# EAGLE board KMO_IO_MV2_3 (EAGLE 9.4.0)
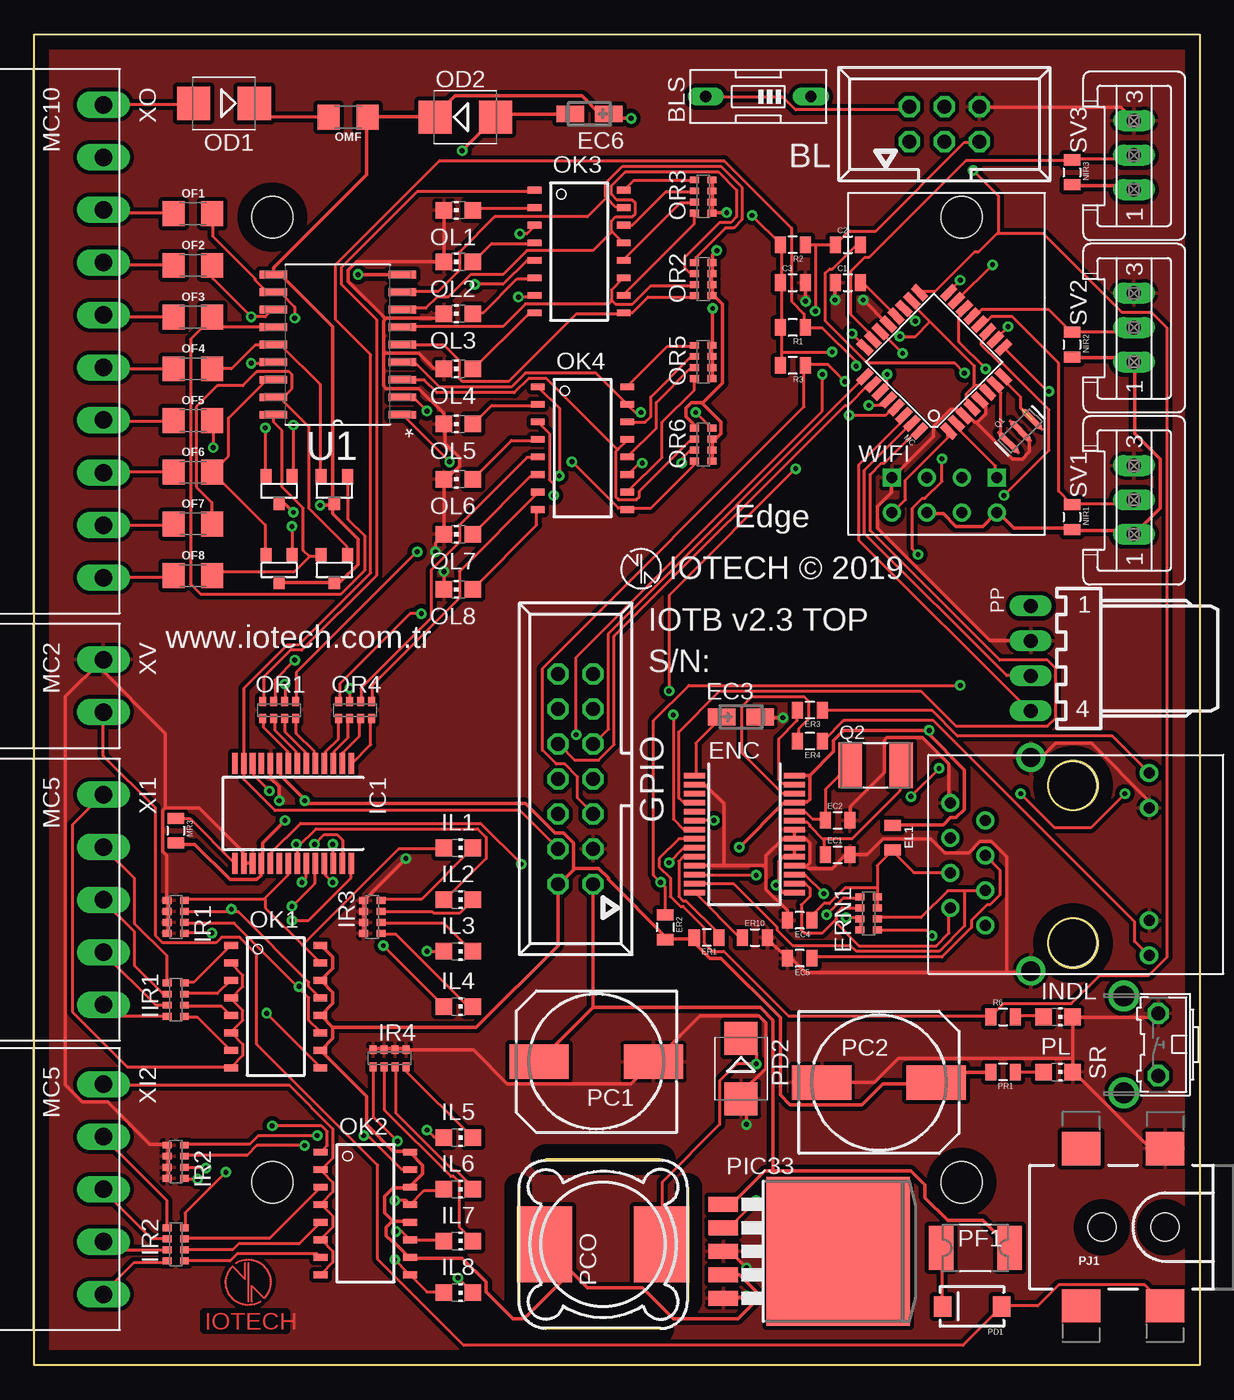
[diagram p2: board, top side]
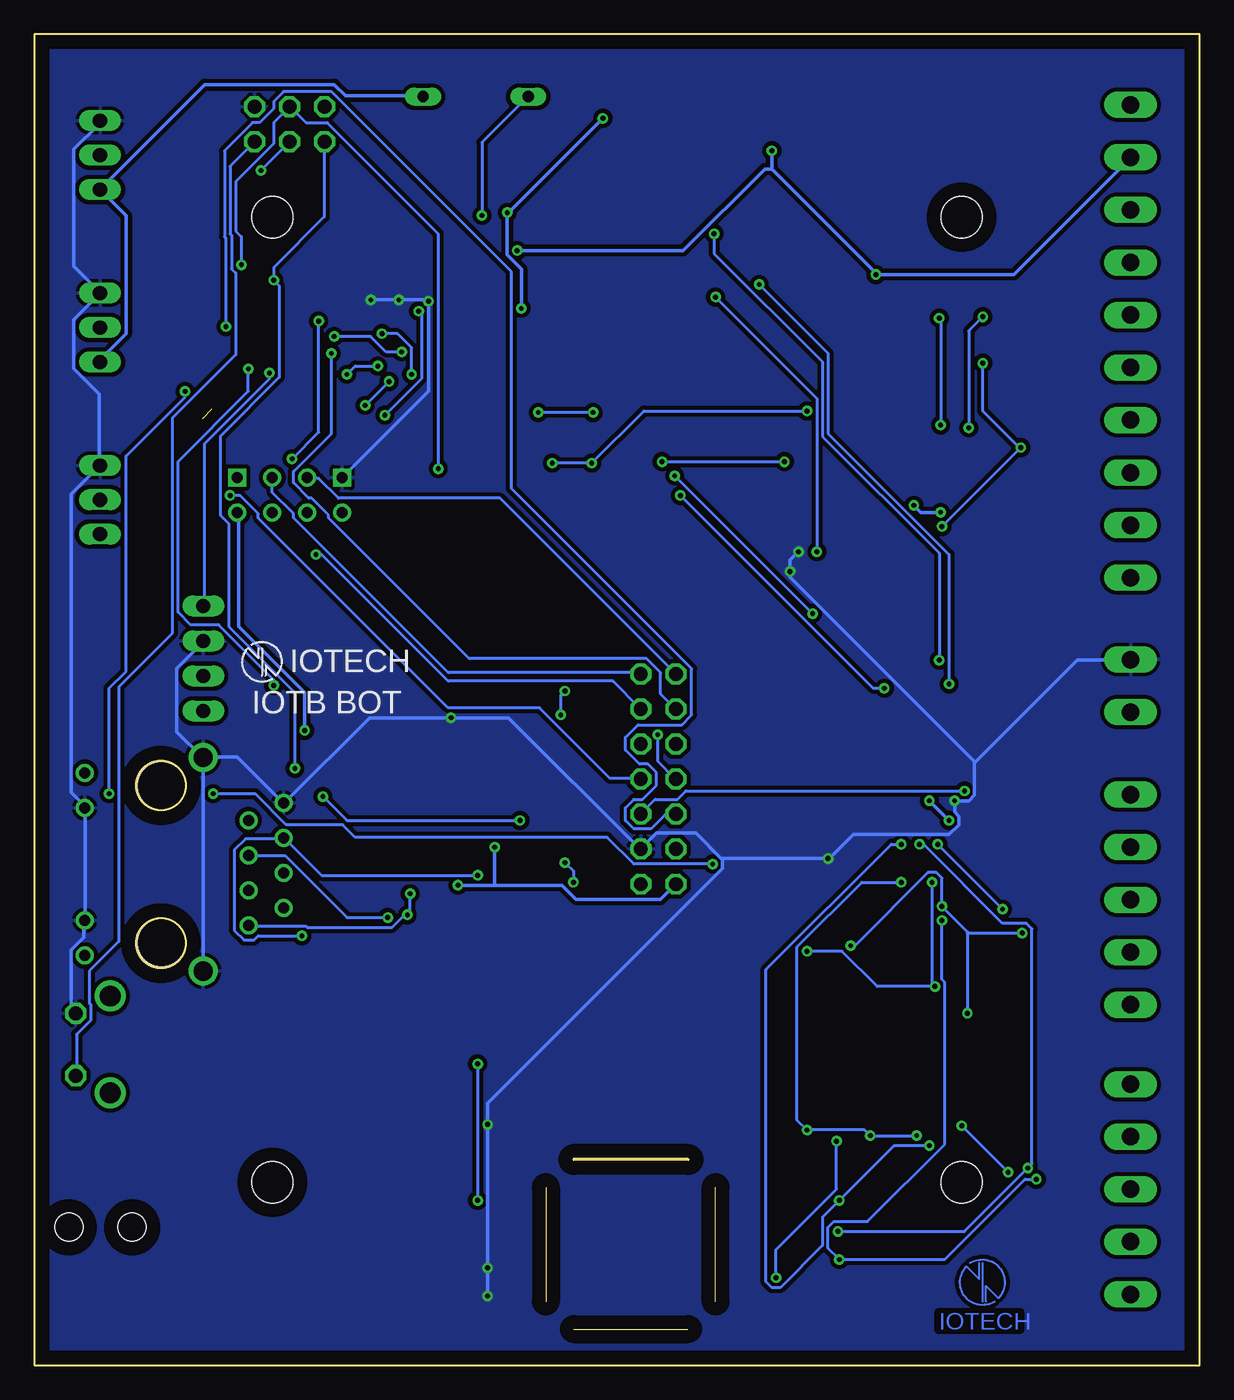
[diagram p3: board, bottom side, seen from below]

Size 84.5 x 96.5 mm. Coordinates in mm from the lower left corner, seen from the top.
Outline: 0,0 0,96.5 84.5,96.5 84.5,0 0,0
Copper layers (1*16): Top 0.035mm / dielectric 1.5mm / Bottom 0.035mm
Design rules "KMO_IO_M": minimum track width 6mil, minimum drill 0.35mm, track to track 0.205mm, track to pad 0.205mm, pad to pad 0.205mm, via to via 0.205mm, smd to smd 6mil, copper to edge 40mil, drill to drill 6mil, minimum pad ring 10mil, minimum via ring 8mil, stop-mask expansion 4mil, vias tented up to drill 0mil, thermal gap 10mil
Net classes: 0 default: width 0.203 mm, drill 0.3 mm, clearance 0.16 mm; 1 vcc: width 0.254 mm, drill 0.3 mm, clearance 0.16 mm; 2 3.3 power line: width 0.254 mm, drill 0.3 mm, clearance 0.16 mm; 3 outsise power line: width 0.254 mm, drill 0.3 mm, clearance 0.16 mm
Holes 3 mm at 17.25,83.25 67.25,83.25 17.25,13.25 67.25,13.25

## Footprints (pad centres in the part's own frame; a part is rotated, then mirrored left to right if it is on the bottom)
057-006-1 = drill 1 octagon: 1 -2.54,-1.27; 2 -2.54,1.27; 3 0,-1.27; 4 0,1.27; 5 2.54,-1.27; 6 2.54,1.27
EDG-01 = drill 0.813 long: 1 0,-3.81; 2 0,3.81
0805 = smd 0.8 x 1.2: 1 -0.9,0; 2 0.9,0
SOT-23-3 = smd 0.802 x 0.972: 1 -0.95,-1; 2 0.95,-1; 3 0,1
CT3216 = smd 2 x 1.2: + -1.4,0; - 1.4,0
SSOP28 = smd 0.4 x 1.5: 1 -4.225,-3.625; 2 -3.575,-3.625; 3 -2.925,-3.625; 4 -2.275,-3.625; 5 -1.625,-3.625; 6 -0.975,-3.625; 7 -0.325,-3.625; 8 0.325,-3.625; 9 0.975,-3.625; 10 1.625,-3.625; 11 2.275,-3.625; 12 2.925,-3.625; 13 3.575,-3.625; 14 4.225,-3.625; 15 4.225,3.625; 16 3.575,3.625; 17 2.925,3.625; 18 2.275,3.625; 19 1.625,3.625; 20 0.975,3.625; 21 0.325,3.625; 22 -0.325,3.625; 23 -0.975,3.625; 24 -1.625,3.625; 25 -2.275,3.625; 26 -2.925,3.625; 27 -3.575,3.625; 28 -4.225,3.625
0603-ARV = smd 0.5 x 0.65: 1 -1.2,-0.625; 2 -0.4,-0.625; 3 0.4,-0.625; 4 1.2,-0.625; 5 1.2,0.625; 6 0.4,0.625; 7 -0.4,0.625; 8 -1.2,0.625
057-014-1 = drill 1 octagon: 1 -7.62,-1.27; 2 -7.62,1.27; 3 -5.08,-1.27; 4 -5.08,1.27; 5 -2.54,-1.27; 6 -2.54,1.27; 7 0,-1.27; 8 0,1.27; 9 2.54,-1.27; 10 2.54,1.27; 11 5.08,-1.27; 12 5.08,1.27; 13 7.62,-1.27; 14 7.62,1.27
CHIP-LED0805 = smd 1.2 x 1.2: A 0,-1.05; C 0,1.05
TQFP32-08 = smd 1.27 x 0.559: 1 -4.293,2.8; 2 -4.293,2; 3 -4.293,1.2; 4 -4.293,0.4; 5 -4.293,-0.4; 6 -4.293,-1.2; 7 -4.293,-2; 8 -4.293,-2.8; 17 4.293,-2.8; 18 4.293,-2; 19 4.293,-1.2; 20 4.293,-0.4; 21 4.293,0.4; 22 4.293,1.2; 23 4.293,2; 24 4.293,2.8 | smd 0.559 x 1.27: 9 -2.8,-4.293; 10 -2,-4.293; 11 -1.2,-4.293; 12 -0.4,-4.293; 13 0.4,-4.293; 14 1.2,-4.293; 15 2,-4.293; 16 2.8,-4.293; 25 2.8,4.293; 26 2,4.293; 27 1.2,4.293; 28 0.4,4.293; 29 -0.4,4.293; 30 -1.2,4.293; 31 -2,4.293; 32 -2.8,4.293
SMB = smd 2.4 x 2.4: A 2.2,0; C -2.2,0
1206 = smd 1.6 x 1.8: 1 -1.4,0; 2 1.4,0
MINI-FLAT-16 = smd 1 x 0.5: 1 -3.24,4.445; 2 -3.24,3.175; 3 -3.24,1.905; 4 -3.24,0.635; 5 -3.24,-0.635; 6 -3.24,-1.905; 7 -3.24,-3.175; 8 -3.24,-4.445; 9 3.24,-4.445; 10 3.24,-3.175; 11 3.24,-1.905; 12 3.24,-0.635; 13 3.24,0.635; 14 3.24,1.905; 15 3.24,3.175; 16 3.24,4.445
140CLH-1010 = smd 4.3 x 2.5: + 4.15,0; - -4.15,0
MSS1260 = smd 5.5 x 4: P$1 0,4.25; P$2 0,-4.25
SMA-DIODE = smd 1.27 x 1.47: A -2.15,0; C 2.15,0
1820 = smd 1.78 x 3.2: 1 -2.49,0; 2 2.49,0
TO263-5 = smd 1.067 x 2.159: 1 -3.404,-5.791; 2 -1.702,-5.791; 3 0,-5.791; 4 1.702,-5.791; 5 3.404,-5.791 | smd 10.8 x 10.41: 6 0,2.54
POWER_JACK_SMD_OVERPASTE_TOE = smd 2.8 x 2.4: GND 0,-5.7; P$4 6.1,-5.7; VIN0 0,5.7; VIN1 6.1,5.7 | hole 2.032: 0,0; 4.572,0
7395-04 = drill 1.016 long: 1 3.81,0; 2 1.27,0; 3 -1.27,0; 4 -3.81,0
RESONATOR-SMD-1:1 = smd 0.45 x 1.905: 1 -1.2,0; 2 0,0; 3 1.2,0
5.0X3.2_2 = smd 1.7 x 3.3: 1 -1.85,0; 2 1.85,0
B3F-31XX = drill 1.016 octagon: 1 -2.261,-1.245; 2 2.261,-1.245 | drill 1.499 pad 2.159: 3 -3.505,1.245; 4 3.505,1.245
S03P = drill 1.016 long: 1 2.5,0; 2 0,0; 3 -2.5,0
SOIC127P1030X265-18N = smd 1.981 x 0.559: 1 -4.674,5.08; 2 -4.674,3.81; 3 -4.674,2.54; 4 -4.674,1.27; 5 -4.674,0; 6 -4.674,-1.27; 7 -4.674,-2.54; 8 -4.674,-3.81; 9 -4.674,-5.08; 10 4.674,-5.08; 11 4.674,-3.81; 12 4.674,-2.54; 13 4.674,-1.27; 14 4.674,0; 15 4.674,1.27; 16 4.674,2.54; 17 4.674,3.81; 18 4.674,5.08
RJ45 = drill 0.8: G+ 5.84,-6.305; G- 5.84,-3.765; GND -8.57,4.76; NC -6.03,3.5; P4 -8.57,-0.32; P5 -6.03,0.96; RD+ -6.03,-1.58; RD- -8.57,2.22; TD+ -6.03,-4.12; TD- -8.57,-2.86; Y+ 5.84,6.945; Y- 5.84,4.405 | drill 1.4: SHIELD1 -2.73,-7.425; SHIELD2 -2.73,8.065 | hole 3.5: 0.3,-5.38; 0.3,6.02
ESP01 = drill 0.8: CH_PD -1.285,-8.178; GPIO0 1.255,-5.638; GPIO2 -1.285,-5.638; RST 1.255,-8.178; TX -3.825,-8.178; VCC 3.795,-8.178 | drill 0.8 square: GND -3.825,-5.638; RX 3.795,-5.638
MC5 = drill 1.27 long: 1 -7.62,0; 2 -3.81,0; 3 0,0; 4 3.81,0; 5 7.62,0
MC10 = drill 1.27 long: 1 -17.145,0; 2 -13.335,0; 3 -9.525,0; 4 -5.715,0; 5 -1.905,0; 6 1.905,0; 7 5.715,0; 8 9.525,0; 9 13.335,0; 10 17.145,0
MC2 = drill 1.27 long: 1 -1.905,0; 2 1.905,0

## Placement (x,y rotation side)
BL  057-006-1  [057-006-1]  66,90 0 top
BLS  on-off  [EDG-01]  52.5,92 90 top
C1  100nF  [0805]  59,78.5 0 top
C2  100nF  [0805]  59,81.25 0 top
C3  100nF  [0805]  55,78.5 0 top
D1  BAV70  [SOT-23-3]  21.75,57.75 180 top
D2  BAV70  [SOT-23-3]  17.75,57.75 180 top
D3  BAV70  [SOT-23-3]  21.75,63.5 180 top
D4  BAV70  [SOT-23-3]  17.75,63.5 180 top
EC1  18p  [0805]  58.25,37 0 top
EC2  18p  [0805]  58.25,39.5 0 top
EC3  10u  [CT3216]  51.25,47 0 top
EC4  10n  [0805]  55.5,32.25 180 top
EC5  10n  [0805]  55.5,29.5 180 top
EC6  10u  [CT3216]  40.25,90.75 180 top
EL1  10µH  [0805]  62.25,38.25 270 top
ENC  ENC28J60-SSOP  [SSOP28]  51.5,38.5 270 top
ER1  10k  [0805]  48.75,31 180 top
ER2  10k  [0805]  45.75,31.75 270 top
ER3  1k  [0805]  56.25,47.5 180 top
ER4  1k  [0805]  56.25,45.25 180 top
ER10  2.7K  [0805]  52.25,31 0 top
ERN1  49.9R  [0603-ARV]  60.5,32.75 270 top
GPIO  057-014-1  [057-014-1]  39.25,42.5 90 top
IC1  MCP23017SS  [SSOP28]  18.75,40 180 top
IIR1  6.8K  [0603-ARV]  10.25,26.5 270 top
IIR2  6.8K  [0603-ARV]  10.25,8.75 270 top
IL1  BLU  [CHIP-LED0805]  30.75,37.5 270 top
IL2  BLU  [CHIP-LED0805]  30.75,33.75 270 top
IL3  BLU  [CHIP-LED0805]  30.75,30 270 top
IL4  BLU  [CHIP-LED0805]  30.75,26 270 top
IL5  BLU  [CHIP-LED0805]  30.75,16.5 270 top
IL6  BLU  [CHIP-LED0805]  30.75,12.75 270 top
IL7  BLU  [CHIP-LED0805]  30.75,9 270 top
IL8  BLU  [CHIP-LED0805]  30.75,5.25 270 top
INDL  BLU  [CHIP-LED0805]  74.25,25.25 270 top
IR1  10K  [0603-ARV]  10.25,32.5 90 top
IR2  10K  [0603-ARV]  10.25,14.75 90 top
IR3  1K  [0603-ARV]  24.5,32.5 270 top
IR4  1K  [0603-ARV]  25.75,22.25 180 top
MC  ATMEGA328  [TQFP32-08]  65.25,72.75 135 top
MR3  10K  [0805]  10.25,38.75 270 top
NIR1  4700  [0805]  75.25,61.5 270 top
NIR2  4700  [0805]  75.25,74 270 top
NIR3  4700  [0805]  75.25,86.5 270 top
OD1  SS54  [SMB]  13.75,91.5 180 top
OD2  28V  [SMB]  31.25,90.5 0 top
OF1  100mA  [1206]  11.5,83.5 0 top
OF2  100mA  [1206]  11.5,79.75 0 top
OF3  100mA  [1206]  11.5,76 0 top
OF4  100mA  [1206]  11.5,72.25 0 top
OF5  100mA  [1206]  11.5,68.5 0 top
OF6  100mA  [1206]  11.5,64.75 0 top
OF7  100mA  [1206]  11.5,61 0 top
OF8  100mA  [1206]  11.5,57.25 0 top
OK1  TLP283-4  [MINI-FLAT-16]  17.5,26 0 top
OK2  TLP283-4  [MINI-FLAT-16]  24,11 0 top
OK3  TLP283-4  [MINI-FLAT-16]  39.5,80.75 0 top
OK4  TLP283-4  [MINI-FLAT-16]  39.75,66.5 0 top
OL1  BLU  [CHIP-LED0805]  30.75,83.75 90 top
OL2  BLU  [CHIP-LED0805]  30.75,80 90 top
OL3  BLU  [CHIP-LED0805]  30.75,76.25 90 top
OL4  BLU  [CHIP-LED0805]  30.75,72.25 90 top
OL5  BLU  [CHIP-LED0805]  30.75,68.25 90 top
OL6  BLU  [CHIP-LED0805]  30.75,64.25 90 top
OL7  BLU  [CHIP-LED0805]  30.75,60.25 90 top
OL8  BLU  [CHIP-LED0805]  30.75,56.25 90 top
OMF  750mA  [1206]  22.75,90.5 180 top
OR1  1K  [0603-ARV]  17.75,47.5 180 top
OR2  10K  [0603-ARV]  48.5,78.75 270 top
OR3  10K  [0603-ARV]  48.5,84.75 270 top
OR4  1K  [0603-ARV]  23.25,47.5 180 top
OR5  10K  [0603-ARV]  48.5,72.75 270 top
OR6  10K  [0603-ARV]  48.5,66.75 270 top
PC1  220uf 50v  [140CLH-1010]  40.75,22 180 top
PC2  220uf 50v  [140CLH-1010]  61.25,20.5 0 top
PCO  220 uh  [MSS1260]  41.25,8.75 90 top
PD1  M7  [SMA-DIODE]  68,4.25 180 top
PD2  SS54  [SMB]  51.25,21.5 270 top
PF1  1A  [1820]  68.25,8.5 0 top
PIC33  LM2596S  [TO263-5]  55.75,8.25 270 top
PJ1  POWER_JACKTOE  [POWER_JACK_SMD_OVERPASTE_TOE]  82,10 180 top
PL  GRN  [CHIP-LED0805]  74.25,21.25 270 top
PP  22-05-7048-04  [7395-04]  72.25,51.25 90 top
PR1  1k  [0805]  70.25,21.25 180 top
Q1  8MHz  [RESONATOR-SMD-1:1]  71.5,67.75 45 top
Q2  25MHz  [5.0X3.2_2]  61,43.5 0 top
R1  1.5K  [0805]  55,75.25 180 top
R2  10K  [0805]  55,81.25 180 top
R3  1.5K  [0805]  55,72.5 180 top
R6  1k  [0805]  70.25,25.25 0 top
SR  gnd  [B3F-31XX]  80.25,23.25 90 top
SV1  3.3V  [S03P]  79.75,62.75 270 top
SV2  3.3V  [S03P]  79.75,75.25 270 top
SV3  3.3V  [S03P]  79.75,87.75 270 top
U1  ULN2803ADW  [SOIC127P1030X265-18N]  22,74 180 top
U$1  [IOTECH_COPPER_W_TEXT]  15.5,6 0 top
U$2  HR911105A  [RJ45]  75,36 0 top
U$4  [IOTECH_COPPER_W_TEXT]  15.75,6 0 bottom
WIFI  ESP01  [ESP01]  66,70 0 top
XI1  MC5  [MC5]  5,33.75 270 top
XI2  MC5  [MC5]  5,12.75 270 top
XO  MC10  [MC10]  5,74.25 270 top
XV  MC2  [MC2]  5,49.25 270 top

## Tracks (layer width: path | path; a pad name or v marks a point on that pad's centre or on a via)
+3V3  (via drill 0.35)
  Top 0.254: NIR2.2 75.31,73.07 79.39,73.07 79.7,72.76 SV2.1 79.8,72.66 79.8,67.56 81.64,65.72 81.64,62.15 79.8,60.31 SV1.1 79.7,60.31 79.5,60.52 75.31,60.52 NIR1.2 75.21,60.72 71.03,60.72 69.9,61.84 WIFI.VCC 69.7,61.74 68.78,60.82 66.84,60.82 65.92,61.74 64.8,61.74 WIFI.CH_PD | NIR3.2 75.31,85.52 79.5,85.52 79.7,85.31 SV3.1 | PIC33.4 50.01,6.53 51.13,6.53 52.35,5.31 52.35,4.69 51.02,3.37 46.33,3.37 44.09,5.61 40.11,5.61 37.04,8.67 PCO.P$1 38.88,6.74 35.51,3.37 34.7,3.37 32.76,5.31 32.76,6.02 31.02,7.76 27.35,7.76 OK2.10 27.14,7.86 26.02,8.98 25.92,8.98 25.51,9.39 25.51,10 25.92,10.41 | 21.64,24.49 21.64,23.68 20.82,22.86 OK1.10 20.82,22.76 24.08,19.49 24.08,17.45 26.02,15.51 27.14,15.51 OK2.16 27.25,15.41 28.17,14.49 28.17,13.88 27.25,12.96 OK2.14 27.14,12.86 26.02,12.86 25.41,12.25 25.41,11.02 25.92,10.51 25.92,10.41 | 21.64,24.49 20.82,25.31 OK1.12 20.82,25.41 21.64,26.23 21.64,27.04 20.82,27.86 OK1.14 20.82,27.96 21.64,28.78 21.64,29.59 20.82,30.41 OK1.16 | 25.92,10.41 27.14,10.41 OK2.12 | 64.75,45.87 64.6,46.02 58.68,46.02 57.96,45.31 57.96,44.49 56.23,42.76 | 64.75,45.87 67.45,43.17 67.45,40.31 66.84,39.7 66.44,39.7 65.92,39.19 62.25,39.19 EL1.1 | 56.23,42.76 55.21,42.76 ENC.28 | 56.23,42.76 56.23,41.02 56.02,40.82 55.21,40.82 ENC.25 55.11,40.72 54.29,40.72 v51.13,37.55 | PR1.2 69.29,21.23 66.13,21.23 65.41,20.51 PC2.+ 65.31,20.41 61.54,20.41 60.01,18.88 54.8,18.88 54.09,19.59 54.09,25.21 49.8,29.49 48.98,29.49 47.66,30.82 ER1.2 47.76,30.92 45.82,30.92 ER2.2 45.82,31.02 41.64,35.21 41.64,35.31 40.92,36.02 39.09,36.02
  Top 0.254: MR3.2 10.31,37.76 11.63,37.76 14.19,35.21 16.12,35.21 16.43,35.51 16.43,36.33 IC1.18 16.53,36.43 16.53,37.86 v18.16,39.49 | 53.98,34.8 53.98,36.53 54.29,36.84 55.11,36.84 ENC.19 55.11,36.94 55.11,37.45 ENC.20 | 53.98,34.8 53.98,34.59 54.29,34.29 55.11,34.29 ENC.15 | 19.64,40.97 19.9,40.72 35.62,40.72 37.76,38.58 38.37,38.58 39.09,37.86 39.09,36.02 | 19.64,40.97 17.86,42.76 17.86,43.58 IC1.9 | 39.09,36.02 39.09,35.92 38.06,34.9 GPIO.2 37.96,34.8 37.96,30.41 32.04,24.49 21.64,24.49 | v53.78,34.8 53.98,34.8 | v19.59,40.92 19.64,40.97 | 64.75,45.87 v64.9,46.02
  Bottom 0.254: BLS.1 56.33,92.05 61.94,92.05 62.76,92.86 72.15,92.86 79.7,85.31 SV3.1 79.7,85.21 77.86,83.38 77.86,74.8 79.7,72.97 79.7,72.76 SV2.1 | 51.13,34.8 46.23,34.8 45.21,33.78 39.09,33.78 38.06,34.8 GPIO.2 | 51.13,34.8 v53.78,34.8 | v19.59,40.92 v18.16,39.49 | 51.13,34.8 v51.13,37.55 | v64.9,46.02 64.9,48.78 69.7,53.58 69.7,61.74 WIFI.VCC
A0
  Top 0.203: SV3.2 79.7,87.66 79.5,87.46 75.31,87.46 NIR3.1 75.21,87.36 67.56,87.36 60.52,80.31 60.21,80.31 59.19,79.29 59.19,76.23 60.72,74.7 60.72,74.39 MC.23
A1  (via drill 0.35)
  Top 0.203: v59.29,74.8 60.21,73.88 MC.24 | v57.15,71.84 57.15,69.19 39.29,51.33 v39.29,45.72
  Bottom 0.203: v59.29,74.8 58.17,74.8 57.15,73.78 v57.15,71.84 | v39.29,45.72 39.29,43.78 38.06,42.55 GPIO.8
A2
  Top 0.203: MC.25 60.21,71.64 41.64,53.07 41.64,46.13 40.62,45.11 GPIO.9
A3
  Top 0.203: MC.26 60.72,71.13 60.52,71.13 58.98,69.6 58.78,69.6 42.05,52.86 42.05,45 40.92,43.88 39.19,43.88 38.06,45 GPIO.10
A4  (via drill 0.35)
  Top 0.203: v59.6,72.46 59.6,72.76 57.15,75.21 55.92,75.21 R1.1 55.82,75.31 55.82,76.23 54.9,77.15 54.9,82.46 50.01,87.36 29.39,87.36 21.84,79.8 21.84,75.82 24.39,73.27 24.39,57.45 19.18,52.25 18.37,52.25 15.21,49.09 15.21,43.68 IC1.13 15.21,43.58 15.21,42.45 17.45,40.21 35.21,40.21 37.96,37.45 GPIO.4 | v61.84,71.84 61.84,71.03 61.43,70.62 MC.27
  Bottom 0.203: v59.6,72.46 61.23,72.46 v61.84,71.84
A5  (via drill 0.35)
  Top 0.203: v58.78,71.33 57.56,72.56 55.92,72.56 R3.1 55.82,72.46 55.82,69.5 36.84,50.52 36.84,44.6 37.86,43.58 38.47,43.58 39.39,42.66 39.39,41.13 40.51,40 GPIO.5 | v60.52,69.6 61.54,69.6 61.84,69.9 MC.28 | v17.04,41.64 15.92,42.76 15.92,43.58 IC1.12
  Bottom 0.203: v60.52,69.6 v58.78,71.33 | v17.04,41.64 37.25,41.64 37.86,41.02 39.49,41.02 40.51,40 GPIO.5
A6  (via drill 0.35)
  Top 0.203: v63.88,75.72 63.07,76.54 MC.19 | v65.82,65.72 65.82,64.09 64.6,62.86 64.39,62.86 63.68,62.15 63.68,59.19 v64.09,58.78
  Bottom 0.203: v63.88,75.72 63.88,67.66 v65.82,65.72 | v64.09,58.78 63.68,58.78 54.49,49.6 42.55,49.6 40.62,47.66 GPIO.11
A7  (via drill 0.35)
  Top 0.203: v62.97,73.37 61.43,74.91 MC.22
  Bottom 0.203: v62.97,73.37 62.97,67.56 65.72,64.8 65.72,63.98 64.6,62.86 64.39,62.86 63.17,61.64 63.17,61.43 52.96,51.23 40.11,51.23 39.09,50.21 39.09,48.68 38.06,47.66 GPIO.12
AREF
  Top 0.203: C1.2 59.9,78.48 60.11,78.48 62.45,76.13 MC.20
BLV  (via drill 0.35)
  Top 0.203: 68.17,71.03 67.56,70.42 67.56,70.11 67.97,69.7 67.97,69.5 MC.4 | 68.17,71.03 68.68,71.03 69.09,70.62 MC.6 | 64.95,75.67 68.17,72.46 68.17,71.03 | 64.95,75.67 63.68,76.95 63.68,77.15 MC.18 | 54.19,73.48 54.19,75.21 R1.2 54.19,75.31 54.19,78.48 C3.1 54.19,78.58 54.19,81.23 R2.2 54.09,81.33 v52.05,83.38 | 54.19,73.48 54.19,72.56 R3.2 | BLS.2 48.78,91.95 54.29,91.95 55.21,91.03 63.17,91.03 63.37,91.23 BL.2 | 64.95,75.67 63.88,74.6 v62.76,74.6 | 54.19,73.48 v57.86,73.48
  Bottom 0.203: v52.05,83.38 52.05,88.68 48.78,91.95 BLS.2 | v62.76,74.6 60.11,74.6 58.98,73.48 v57.86,73.48
COM1
  Top 0.203: OK1.2 14.29,29.08 15.1,28.27 15.1,27.45 14.29,26.64 OK1.4 14.29,26.53 15.1,25.72 15.1,25 14.29,24.19 OK1.6 14.29,24.08 15.1,23.27 15.1,22.45 14.29,21.64 OK1.8 14.19,21.64 6.74,21.64 2.75,25.61 2.75,39.19 4.9,41.33 XI1.1
COM2
  Top 0.203: OK2.8 20.82,6.63 21.64,7.45 21.64,8.27 20.82,9.08 OK2.6 20.82,9.18 21.64,10 21.64,10.82 20.82,11.63 OK2.4 20.82,11.74 21.64,12.55 21.64,13.27 20.82,14.08 OK2.2 20.82,14.19 21.64,15 21.64,17.14 18.47,20.31 5,20.31 XI2.1
D2
  Top 0.203: MC.32 64.19,67.66 63.88,67.66 61.64,65.41 61.43,65.41 60.62,64.6 60.62,60.52 70.01,51.13 73.48,51.13 74.09,50.52 74.09,46.94 73.48,46.33 66.84,46.33 64.29,48.88 49.7,48.88 46.74,45.92 46.74,41.13 47.05,40.82 47.86,40.82 ENC.4
D3
  Top 0.203: MC.1 66.23,67.66 66.23,67.25 63.17,64.19 63.17,62.76 62.25,61.84 WIFI.TX
D4
  Top 0.203: MC.2 66.94,68.27 66.94,67.97 69.7,65.21 69.7,64.39 WIFI.RX
D5  (via drill 0.35)
  Top 0.203: v73.58,70.62 73.48,70.62 70.31,73.78 MC.9 | v79.09,41.43 76.64,38.98 73.99,38.98 v71.54,41.43 | v35.31,36.33 32.35,39.29 19.29,39.29 17.14,37.15 17.14,36.43 IC1.19
  Bottom 0.203: v73.58,70.62 73.58,70.21 77.86,65.92 77.86,50.31 79.09,49.09 v79.09,41.43 | v71.54,41.43 68.48,41.43 66.23,39.19 62.15,39.19 61.23,38.27 42.96,38.27 41.02,36.33 v35.31,36.33
D6  (via drill 0.35)
  Top 0.203: v70.62,75.31 69.7,74.39 MC.10
  Bottom 0.203: v70.62,75.31 70.62,81.74 70.72,81.84 70.72,88.07 68.68,90.11 68.17,90.11 67.15,91.13 67.15,91.64 66.44,92.36 62.97,92.36 49.9,79.29 49.9,63.58 36.84,50.52 36.84,47.15 37.55,46.43 40.72,46.43 41.64,45.51 41.64,44.6 40.62,43.58 40,43.58 39.39,42.96 39.39,42.05 40.41,41.02 41.02,41.02 41.64,40.41 41.64,39.49 41.02,38.88 39.8,38.88 38.78,39.9 38.06,39.9 GPIO.6
D7  (via drill 0.35)
  Top 0.203: v70.31,63.07 73.58,66.33 73.58,69.29 70.21,72.66 70.01,72.66 68.68,73.99 68.68,74.19 69.09,74.6 69.09,74.91 MC.11
  Bottom 0.203: v70.31,63.07 69.6,63.07 68.27,61.74 68.27,61.43 54.49,47.66 47.86,47.66 42.76,42.55 40.62,42.55 GPIO.7
D8
  Top 0.203: SV1.2 79.7,62.66 79.5,62.45 75.31,62.45 NIR1.1 75.21,62.45 74.29,63.37 74.29,72.66 70.92,76.03 69.39,76.03 68.88,75.52 68.58,75.52 MC.12
D9
  Top 0.203: SV2.2 79.7,75.21 79.39,74.91 75.31,74.91 NIR2.1 75.21,74.91 73.58,76.54 68.68,76.54 68.27,76.13 68.07,76.13 MC.13
D10  (via drill 0.35)
  Top 0.203: v46.02,36.43 47.05,37.45 47.86,37.45 ENC.9 | ER2.1 45.72,32.66 45.72,34.7 v45.41,35 44.9,35.51 44.9,46.74 47.45,49.29 v67.15,49.29 | v68.99,72.25 67.05,74.19 67.05,76.03 67.35,76.33 67.35,76.54 MC.14
  Bottom 0.203: v45.41,35 45.41,35.82 v46.02,36.43 | v68.99,72.25 68.99,70.62 74.09,65.52 74.09,54.6 73.17,53.68 71.13,53.68 67.15,49.7 v67.15,49.29
D11  (via drill 0.35)
  Top 0.203: v69.5,79.8 66.94,77.25 MC.15 | v46.33,47.15 46.33,39.59 47.05,38.88 47.86,38.88 ENC.7 | v46.02,48.88 46.02,55.82 v55.21,65.01
  Bottom 0.203: v69.5,79.8 69.5,81.84 69.9,82.25 69.9,85.82 67.15,88.58 67.15,90.11 66.03,91.23 BL.4 65.92,91.23 64.8,90.11 63.27,90.11 55.21,82.05 v55.21,65.01 | v46.33,47.15 46.33,48.58 v46.02,48.88
D12  (via drill 0.35)
  Top 0.203: v67.15,78.68 66.33,77.86 MC.16 | v49.29,39.49 47.96,39.49 ENC.6 | v65.62,43.27 v63.58,41.23
  Bottom 0.203: BL.1 63.48,88.68 63.48,83.27 67.15,79.6 v67.15,78.68 66.74,78.27 66.74,71.64 71.03,67.35 71.03,61.64 70.42,61.03 70.42,53.58 65.62,48.78 v65.62,43.27 | v49.29,39.49 61.84,39.49 v63.58,41.23
D13  (via drill 0.35)
  Top 0.203: 69.85,82.1 69.9,82.15 69.9,84.8 v68.07,86.64 | 69.85,82.1 68.48,80.72 68.17,80.72 65.31,77.86 64.29,77.86 MC.17 | ENC.8 47.86,38.17 46.74,38.17 45.31,36.74 45.31,36.13 46.13,35.31 46.13,33.98 46.84,33.27 47.05,33.27 48.58,31.74 48.58,30.61 49.19,30 50.01,30 54.7,25.31 69.29,25.31 R6.1 69.39,25.31 70.31,26.23 75.21,26.23 77.25,28.27 80.82,28.27 82.15,29.59 82.15,75.21 81.03,76.33 78.89,76.33 73.17,82.05 69.9,82.05 69.85,82.1
  Bottom 0.203: v68.07,86.64 66.03,88.68 BL.3
DTR  (via drill 0.35)
  Top 0.203: v67.45,71.94 66.74,72.66 60.41,72.66 57.35,75.72 57.35,79.19 57.66,79.5 57.86,79.5 59.6,81.23 59.8,81.23 C2.2
  Bottom 0.203: v67.45,71.94 67.45,71.54 72.15,66.84 72.15,55.11 PP.1
EP4
  Top 0.203: ERN1.7 61.13,33.17 61.13,33.88 ERN1.8 61.13,33.98 61.13,34.59 | 61.13,34.59 61.13,36.23 62.15,37.25 EL1.2 62.25,37.25 63.78,35.72 66.33,35.72 U$2.P4 | 61.13,34.59 58.78,34.59 57.66,33.47 57.25,33.47 56.43,32.66 56.43,32.35 EC4.1
EP5  (via drill 0.35)
  Top 0.203: ERN1.4 59.9,31.64 59.9,32.35 ERN1.3 59.8,32.45 v58.88,32.45 | EC5.1 56.43,29.59 65.82,29.59 67.97,31.74 67.97,32.25 69.09,33.37 69.29,33.37 70.01,34.09 70.01,35.92 68.99,36.94 U$2.P5
  Bottom 0.203: v58.88,32.45 61.84,32.45 66.33,36.94 68.88,36.94 U$2.P5
GND  (via drill 0.35)
  Top 0.254: 56.02,36.13 56.13,36.02 57.86,36.02 58.78,36.94 59.09,36.94 EC1.2 59.19,37.04 60.41,37.04 61.54,38.17 65.01,38.17 66.03,37.15 67.76,37.15 68.58,37.96 69.39,37.96 70.52,36.84 70.52,28.47 | 56.02,36.13 55.21,36.13 ENC.18 | 53.07,36.23 53.07,36.94 54.29,38.17 55.11,38.17 ENC.21 | 53.07,36.23 53.07,34.49 54.6,32.96 54.6,32.35 EC4.2 | 53.07,36.23 50.01,36.23 | 50.01,36.23 47.96,36.23 ENC.11 | ENC.22 55.11,38.78 55.11,38.27 ENC.21 | 50.01,36.23 50.01,40.72 48.68,42.05 47.96,42.05 ENC.2 | 56.02,36.13 56.02,36.23 56.23,36.43 56.23,37.86 55.92,38.17 55.21,38.17 ENC.21 | ER10.2 53.17,30.92 EC5.2 54.7,29.49 54.9,29.49 55.92,28.47 70.52,28.47 | 70.52,28.47 72.15,28.47 72.25,28.57 U$2.SHIELD1 | 68.37,68.37 68.17,68.37 67.76,68.78 67.45,68.78 MC.3 67.35,68.88 66.94,69.29 66.44,69.29 65.21,68.07 65.21,67.35 62.25,64.39 WIFI.GND 62.15,64.29 62.15,63.27 61.13,62.25 61.13,60.72 69.29,52.56 72.15,52.56 PP.2 | 68.37,68.37 68.99,68.99 68.99,69.5 68.58,69.9 MC.5 | Q1.2 72.15,66.94 72.15,66.23 71.64,65.72 70.92,65.72 68.37,68.27 68.37,68.37 | v55.92,77.15 55.92,78.48 C3.2 | v58.07,77.25 58.07,78.48 C1.1 | v60.11,77.25 61.84,75.52 MC.21 | EC2.2 59.19,39.59 59.19,40.51 61.64,42.96 61.64,45.31 61.84,45.51 64.39,45.51 66.33,43.58 66.33,40.82 U$2.GND | v54.29,46.94 52.66,46.94 EC3.- | BL.6 68.58,91.23 78.78,91.23 79.7,90.31 SV3.3 | 75.31,22.25 75.31,25.21 INDL.C 75.42,25.21 81.23,25.21 81.44,25.41 SR.2 | 75.31,22.25 75.31,21.33 PL.C 75.42,21.23 80.93,15.72 81.95,15.72 PJ1.GND | 75.31,22.25 62.66,22.25 60.92,20.51 57.15,20.51 PC2.- | U$2.SHIELD2 72.35,44.09 73.07,44.09 74.09,45.11 76.64,45.11 80.82,40.92 80.82,40.41 U$2.Y-
  Top 0.254: IR1.8 9.7,31.33 9.7,32.04 IR1.7 9.7,32.15 9.7,32.86 IR1.6 9.7,32.96 9.7,33.68 IR1.5 9.59,33.78 9.59,36.94 9.29,37.25 9.29,40.21 9.49,40.41 | 9.49,40.41 11.94,40.41 15.1,37.25 15.1,36.43 IC1.16 15.21,36.43 15.82,36.43 IC1.17 | IR2.8 9.7,13.57 9.7,14.29 IR2.7 9.7,14.39 9.7,15.1 IR2.6 9.7,15.21 9.7,15.92 IR2.5 9.59,16.02 8.37,16.02 5.31,19.08 3.47,19.08 2.25,20.31 2.25,48.47 4.9,51.13 XV.1 4.59,50.72 9.49,45.82 9.49,40.41 | v51.64,5 51.53,4.9 50.01,4.9 PIC33.5 | v51.64,7.04 50.52,8.16 50.01,8.16 PIC33.3 | IR4.4 24.59,22.96 25.31,22.96 IR4.3 25.41,22.96 26.12,22.96 IR4.2 26.23,22.96 26.94,22.96 IR4.1 27.04,22.86 31.84,22.86 34.29,20.41 43.27,20.41 44.8,21.94 PC1.- 45,22.04 48.27,25.31 52.56,25.31 53.07,24.8 53.07,21.53 51.33,19.8 51.33,19.39 PD2.A 51.23,19.18 51.64,18.78 v51.64,17.45 | v29.7,57.56 29.7,56.33 OL8.C | v29.08,58.98 29.08,59.6 29.7,60.21 OL7.C 29.7,60.31 29.7,64.19 OL6.C 29.8,64.19 30.82,65.21 30.82,65.82 29.8,66.84 29.8,68.17 OL5.C 29.7,68.37 29.7,68.99 27.86,70.82 25.51,70.82 25.31,71.03 25.31,73.48 25.36,73.53 | OL1.C 29.7,83.68 OL2.C 29.59,80.01 23.37,80.01 22.76,79.39 22.76,78.58 25.46,75.87 | 25.36,73.53 25.31,73.58 25.31,75.72 25.46,75.87 | 25.36,73.53 25.51,73.37 27.86,73.37 28.98,72.25 OL4.C | 25.46,75.87 25.51,75.92 29.39,75.92 29.7,76.23 OL3.C | IR3.4 23.88,31.33 23.88,32.04 IR3.3 23.88,32.15 23.88,32.86 IR3.2 23.88,32.96 23.88,33.68 IR3.1 23.98,33.78 v26.94,36.74 | v17.76,40.92 17.76,41.94 17.14,42.55 17.14,43.58 IC1.10
  Bottom 0.254: WIFI.GND 62.15,64.39 55.92,70.62 v55.92,77.15 55.92,77.25 v58.07,77.25 v60.11,77.25 | PP.2 72.25,52.45 74.19,50.52 74.19,45.92 72.35,44.09 U$2.SHIELD2 | U$2.SHIELD2 72.15,44.09 69.8,44.09 66.54,40.82 U$2.GND 66.33,40.82 60.21,46.94 v54.29,46.94 50.11,46.94 40.62,37.45 GPIO.3 40.51,37.45 39.39,38.58 36.53,38.58 34.7,36.74 34.59,36.74 | U$2.SHIELD1 72.25,28.68 72.25,43.98 U$2.SHIELD2 | SV3.3 79.8,90.21 79.8,90.01 81.64,88.17 81.64,79.7 79.8,77.86 SV2.3 79.8,77.66 81.64,75.82 81.64,72.25 79.8,70.42 79.8,65.31 SV1.3 79.8,65.21 81.84,63.17 81.84,41.53 80.82,40.51 U$2.Y- 80.82,40.31 80.82,32.35 U$2.G- 80.93,32.15 80.93,31.02 81.84,30.11 81.84,25.82 81.54,25.51 SR.2 | v51.64,5 v51.64,7.04 v51.64,17.45 51.64,18.98 34.59,36.02 34.59,36.74 | v29.08,58.98 29.7,58.37 v29.7,57.56 29.7,57.15 16.33,43.78 | 34.59,36.74 v26.94,36.74 26.84,36.74 25.1,38.47 18.16,38.47 17.45,39.19 17.45,39.8 17.76,40.11 v17.76,40.92 16.74,40.92 16.33,41.33 16.33,43.78 | XV.1 5,51.13 8.88,51.13 16.23,43.78 16.33,43.78
  pour Top (isolate 0.305): -5.25,100.25 89.25,100.25 90.5,99 90.5,-3 89.25,-4.25 88.5,-5 -6,-5 -6,99.5
  pour Bottom (isolate 0.305): -7.75,102.25 90.75,102.25 94,99 94,-7.75 93.5,-8.25 -8.25,-8.25 -10,-6.5 -10,100
GNDO  (via drill 0.35)
  Top 0.254: OR6.5 49.19,65.62 49.19,66.33 OR6.6 49.19,66.44 49.19,67.15 OR6.7 49.29,67.05 49.8,67.56 49.8,68.37 48.37,69.8 | 48.37,69.8 47.66,69.8 47.25,69.39 47.25,68.78 47.86,68.17 47.86,67.97 OR6.1 | 48.37,69.8 48.47,69.8 49.9,71.23 49.9,76.95 49.29,77.56 OR2.5 49.19,77.56 49.19,78.27 OR2.6 49.09,78.48 49.09,79.09 OR2.7 49.19,79.19 49.19,79.91 OR2.8 49.19,80.01 49.19,80.52 v49.49,80.82 | EC6.- 38.78,90.72 33.68,90.72 33.47,90.52 OD2.A 33.37,90.42 v31.02,88.07 | v23.47,79.09 26.64,79.09 U1.9
  Bottom 0.254: XO.2 5,87.56 13.47,79.09 v23.47,79.09 23.47,79.19 31.02,86.74 | 31.02,86.74 v31.02,88.07 | v49.49,80.82 37.45,80.82 31.53,86.74 31.02,86.74
GPA0
  Top 0.203: 16.68,33.83 18.37,35.51 18.37,36.33 IC1.21 | 16.68,33.83 16.63,33.78 10.92,33.78 IR1.4 | 19.44,30.46 16.74,33.17 16.74,33.78 16.68,33.83 | 19.44,30.46 20.72,29.19 OK1.15 | 19.44,30.46 26.43,37.45 29.7,37.45 IL1.A
GPA1  (via drill 0.35)
  Top 0.203: 14.29,32.86 14.8,32.86 19.9,27.76 19.9,27.45 20.72,26.64 OK1.13 | 14.29,32.86 10.92,32.86 IR1.3 | 19.13,37.6 19.08,37.55 19.08,36.43 IC1.22 | 19.13,37.6 20.41,38.88 32.15,38.88 32.76,38.27 32.76,36.74 29.8,33.78 IL2.A | v14.29,33.06 14.29,32.86 | 19.13,37.6 v18.98,37.76
  Bottom 0.203: v18.98,37.76 v14.29,33.06
GPA2  (via drill 0.35)
  Top 0.203: 19.13,27.4 19.9,26.64 19.9,25 20.72,24.19 OK1.11 | 19.13,27.4 14.49,32.04 10.92,32.04 IR1.2 | v28.47,30 IL3.A | v19.18,27.45 19.13,27.4 | v19.39,35 19.7,35.31 19.7,36.33 IC1.23
  Bottom 0.203: v28.47,30 25.92,30 23.37,27.45 19.39,27.45 | 19.39,27.45 v19.39,35 | 19.39,27.45 v19.18,27.45
GPA3  (via drill 0.35)
  Top 0.203: v12.86,31.33 10.92,31.33 IR1.1 | v18.68,33.27 20.31,34.9 20.31,36.33 IC1.24 | v16.84,25.51 20.72,21.64 OK1.9 | v25.31,30.41 29.7,26.02 IL4.A
  Bottom 0.203: v12.86,31.33 16.74,31.33 16.79,31.38 | 16.79,31.38 v18.68,33.27 18.68,35.31 19.08,35.72 19.7,35.72 25,30.41 v25.31,30.41 | v16.84,25.51 16.84,31.33 16.79,31.38
GPA4  (via drill 0.35)
  Top 0.203: v20.51,16.63 16.23,16.63 15.61,16.02 10.92,16.02 IR2.4 | v23.88,16.63 24.19,16.63 26.64,14.19 27.14,14.19 OK2.15 | v28.47,17.04 28.98,16.53 29.7,16.53 IL5.A | v21.64,35 21.12,35.51 21.12,36.33 IC1.25
  Bottom 0.203: v20.51,16.63 v23.88,16.63 24.29,17.04 v28.47,17.04 29.19,17.76 29.19,30.31 24.49,35 v21.64,35
GPA5  (via drill 0.35)
  Top 0.203: v19.59,15.92 16.12,15.92 15.41,15.21 10.92,15.21 IR2.3 | v26.12,11.94 26.94,11.94 27.14,11.74 OK2.13 28.27,12.65 29.7,12.65 IL6.A | v21.64,37.76 21.64,36.43 IC1.26
  Bottom 0.203: v19.59,15.92 22.14,15.92 v26.12,11.94 27.35,10.71 27.35,8.67 30.41,5.61 31.02,5.61 31.43,6.02 31.43,28.68 22.35,37.76 v21.64,37.76
GPA6  (via drill 0.35)
  Top 0.203: v12.45,14.29 10.92,14.29 IR2.2 | v26.23,9.7 26.64,9.7 27.14,9.18 OK2.11 27.25,9.08 29.7,9.08 IL7.A | v20.31,37.76 21.02,38.47 21.94,38.47 22.35,38.06 22.35,36.43 IC1.27
  Bottom 0.203: v26.23,9.7 17.04,9.7 v12.45,14.29 12.14,14.59 12.14,31.64 12.55,32.04 14.29,32.04 20,37.76 v20.31,37.76
GPA7  (via drill 0.35)
  Top 0.203: v11.84,13.47 10.92,13.47 IR2.1 | v26.12,7.65 27.14,6.63 OK2.9 27.25,6.53 28.47,5.31 29.7,5.31 IL8.A | v18.68,32.25 19.9,32.25 22.96,35.31 22.96,36.33 IC1.28
  Bottom 0.203: v11.84,13.47 12.65,13.47 18.47,7.65 v26.12,7.65 26.94,8.47 26.94,10 26.53,10.41 24.08,10.41 18.47,16.02 18.47,27.76 18.68,27.96 v18.68,32.25
GPB0
  Top 0.203: OR4.8 24.39,46.84 24.39,45 23.06,43.68 IC1.1
GPB1
  Top 0.203: OR4.7 23.57,46.84 23.57,45.62 22.35,44.39 22.35,43.68 IC1.2
GPB2
  Top 0.203: OR4.6 22.76,46.84 22.76,45.51 21.74,44.49 21.74,43.68 IC1.3
GPB3
  Top 0.203: OR4.5 22.04,46.84 22.04,45.41 21.12,44.49 21.12,43.68 IC1.4
GPB4
  Top 0.203: OR1.8 18.98,46.84 18.98,45.82 20.31,44.49 20.31,43.68 IC1.5
GPB5
  Top 0.203: OR1.7 18.16,46.84 18.16,45.92 19.7,44.39 19.7,43.68 IC1.6
GPB6
  Top 0.203: OR1.6 17.45,46.84 17.45,46.02 18.98,44.49 18.98,43.68 IC1.7
GPB7
  Top 0.203: OR1.5 16.63,46.84 16.63,46.23 18.37,44.49 18.37,43.68 IC1.8
IO5  (via drill 0.35)
  Top 0.203: v47.96,69.09 49.09,67.97 OR6.8 | v43.98,69.09 43.58,69.09 43.06,69.6 OK4.15 42.96,69.7 40.72,71.94 35.62,71.94 34.59,70.92 29.39,70.92 27.66,72.66 26.74,72.66 U1.4
  Bottom 0.203: v43.98,69.09 v47.96,69.09
IO6
  Top 0.203: 42.3,66.38 42.96,67.05 OK4.13 | 42.3,66.38 42.15,66.23 42.15,62.97 42.35,62.76 43.68,62.76 43.88,62.97 43.88,63.37 47.66,67.15 47.86,67.15 OR6.2 | 42.3,66.38 37.15,71.54 35.82,71.54 34.8,70.52 29.19,70.52 28.27,71.44 26.74,71.44 U1.3
IO7  (via drill 0.35)
  Top 0.203: v46.94,65.41 46.94,65.72 47.55,66.33 47.86,66.33 OR6.3 | v44.09,65.41 43.88,65.41 43.06,64.6 OK4.11 | v28.47,69.19 27.55,70.11 26.74,70.11 U1.2
  Bottom 0.203: v46.94,65.41 v44.09,65.41 40.31,69.19 v28.47,69.19
IO8  (via drill 0.35)
  Top 0.203: OR6.4 47.86,65.52 47.86,65.31 44.7,62.15 43.06,62.15 OK4.9 42.96,62.15 42.35,62.15 v38.98,65.52 | v30.11,65.52 26.74,68.88 U1.1
  Bottom 0.203: v38.98,65.52 v30.11,65.52
LEDA
  Top 0.203: ER3.1 57.25,47.45 65.11,47.45 66.94,45.62 78.17,45.62 80.82,42.96 U$2.Y+
LEDB
  Top 0.203: ER4.1 57.25,45.31 58.68,46.74 65.21,46.74 79.8,32.15 79.8,30.72 80.82,29.7 U$2.G+
N$1
  Top 0.203: OD1.A 11.53,91.44 5,91.44 XO.1
N$2
  Top 0.203: PD1.C 65.82,4.29 65.82,8.47 PF1.1
N$3
  Top 0.203: MR3.1 10.31,39.59 11.33,39.59 14.49,36.43 IC1.15
N$4
  Top 0.203: OMF.2 21.33,90.52 16.94,90.52 16.02,91.44 OD1.C
N$5
  Top 0.203: R6.2 71.23,25.31 73.17,25.31 INDL.A
N$6
  Top 0.203: OF8.1 10,57.15 5,57.15 XO.10
N$7
  Top 0.203: D1.1 22.66,58.78 22.66,59.39 19.9,62.15 19.9,68.07 17.86,70.11 17.35,70.11 U1.17 17.96,70.11 18.68,70.82 18.68,71.84 18.47,72.05 16.12,72.05 15.1,71.03 13.27,71.03 11.74,69.5 11.74,63.68 12.86,62.56 12.86,61.03 OF7.2
N$8
  Top 0.203: OR1.4 16.63,48.17 16.63,49.9 18.57,51.84 19.39,51.84 24.8,57.25 24.8,75.82 22.25,78.37 22.25,79.6 27.76,85.11 36.23,85.11 OK3.1
N$9
  Top 0.203: ER3.2 55.31,47.45 55.31,46.74 53.98,45.41 53.98,42.45 54.29,42.15 55.11,42.15 ENC.27
N$10  (1 unrouted)
  Top 0.203: MC.8 70.31,71.64 70.31,71.44 71.54,70.21 71.54,69.39 71.63,69.32
N$11
  Top 0.203: PR1.1 71.23,21.23 73.17,21.23 PL.A
N$12
  Top 0.203: IR3.8 25.21,33.78 28.06,33.78 31.74,37.45 IL1.C
N$13
  Top 0.203: ENC.1 47.96,42.76 47.96,45.11 49.8,46.94 EC3.+
N$14
  Top 0.203: ER4.2 55.41,45.31 55.41,46.13 56.13,46.84 56.13,48.17 55.82,48.47 52.05,48.47 51.33,47.76 51.33,44.39 54.29,41.43 55.11,41.43 ENC.26
N$15
  Top 0.203: MC.7 69.7,70.92 70.11,70.52 70.11,67.56 Q1.1 | MC.7
N$16  (via drill 0.35)
  Top 0.203: v52.35,11.94 50.41,10 50.01,10 PIC33.2 | PD2.C 51.33,23.68 52.35,22.66 v52.35,21.84 50.92,21.84 49.7,20.61 49.7,17.45 45.51,13.27 45.51,8.78 PCO.P$2
  Bottom 0.203: v52.35,21.84 v52.35,11.94
N$17
  Top 0.203: ER1.1 49.6,31.02 49.6,31.33 47.25,33.68 47.05,33.68 46.74,33.98 46.74,36.53 47.05,36.84 47.86,36.84 ENC.10
N$18
  Top 0.203: IIR1.1 9.59,27.76 9.59,29.7 7.25,32.04 7.25,35.31 XI1.2
N$19
  Top 0.203: ER10.1 51.33,31.02 51.13,31.02 47.96,34.19 ENC.14
N$20
  Top 0.203: IR3.7 25.21,32.86 28.88,32.86 28.98,32.76 30.82,32.76 31.74,33.68 IL2.C
N$21
  Top 0.203: IR3.6 25.21,32.04 29.7,32.04 31.74,30 IL3.C
N$22
  Top 0.203: ENC.24 55.21,40.11 55.92,40.11 56.43,39.59 57.25,39.59 EC2.1 57.35,39.59 57.35,41.74 59.09,43.47 Q2.1
N$23
  Top 0.203: IR3.5 25.21,31.23 26.23,31.23 31.43,26.02 31.74,26.02 IL4.C
N$24
  Top 0.203: 57.2,38.12 56.23,39.09 56.23,39.19 56.02,39.39 55.21,39.39 ENC.23 | 57.2,38.12 57.25,38.06 57.25,37.04 EC1.1 | 57.2,38.12 57.25,38.17 59.29,38.17 62.76,41.64 62.76,43.47 Q2.2
N$25
  Top 0.203: IR4.8 27.04,21.53 27.04,21.23 31.74,16.53 IL5.C
N$26
  Top 0.203: IR4.7 26.23,21.53 26.23,18.27 30.41,14.08 30.61,14.08 31.74,12.96 31.74,12.76 IL6.C
N$27
  Top 0.203: IR4.6 25.41,21.53 25.41,18.47 30.21,13.68 30.41,13.68 30.82,13.27 30.82,10 31.74,9.08 IL7.C
N$28
  Top 0.203: IIR1.2 9.59,26.94 9.29,26.94 7.25,28.98 7.25,31.43 5,33.68 XI1.3
N$29
  Top 0.203: IIR1.8 10.92,27.76 11.53,27.76 14.19,30.41 OK1.1
N$30
  Top 0.203: IIR1.7 10.92,26.94 13.27,26.94 14.19,27.86 OK1.3
N$31
  Top 0.203: IIR1.6 10.92,26.02 13.57,26.02 14.19,25.41 OK1.5
N$32
  Top 0.203: IIR1.5 10.92,25.21 11.84,25.21 14.19,22.86 OK1.7
N$33
  Top 0.203: IIR1.3 9.59,26.12 8.78,26.12 5,29.9 XI1.4
N$34
  Top 0.203: IIR1.4 9.59,25.31 5.82,25.31 XI1.5
N$35  (via drill 0.35)
  Top 0.203: v18.88,51.13 17.45,49.7 17.45,48.17 OR1.3 | v35.21,82.05 35.72,82.05 36.23,82.56 OK3.3
  Bottom 0.203: v18.88,51.13 18.88,58.88 27.35,67.35 27.35,72.76 35.21,80.62 v35.21,82.05
N$36
  Top 0.203: IIR2.1 9.59,10 9.59,11.94 5,16.53 XI2.2
N$37  (via drill 0.35)
  Top 0.203: v13.88,13.98 10.92,11.02 10.92,10 IIR2.8 | v17.25,17.35 20.82,17.35 21.23,16.94 21.23,15.92 20.82,15.51 OK2.1
  Bottom 0.203: v17.25,17.35 v13.88,13.98
N$38
  Top 0.203: IIR2.2 9.59,9.18 8.47,9.18 5,12.65 XI2.3
N$39
  Top 0.203: IIR2.7 10.92,9.18 17.04,9.18 20.72,12.86 OK2.3
N$40
  Top 0.203: IIR2.3 9.59,8.37 5.51,8.37 5,8.88 XI2.4
N$41
  Top 0.203: IIR2.6 10.92,8.37 14.39,8.37 14.8,8.78 19.18,8.78 20.72,10.31 OK2.5
N$42
  Top 0.203: IIR2.4 9.59,7.45 7.25,7.45 5,5.21 XI2.5
N$43
  Top 0.203: IIR2.5 10.92,7.55 14.19,7.55 14.7,8.06 20.51,8.06 20.72,7.86 OK2.7
N$44  (via drill 0.35)
  Top 0.203: v26.33,16.23 24.59,17.96 24.59,21.53 IR4.5 | v30.72,6.33 31.74,5.31 IL8.C
  Bottom 0.203: v26.33,16.23 26.33,12.76 30.72,8.37 v30.72,6.33
N$45  (via drill 0.35)
  Top 0.203: v18.16,49.39 18.16,48.17 OR1.2 | v31.94,78.37 33.98,78.37 35.72,80.11 36.23,80.11 OK3.5
  Bottom 0.203: v18.16,49.39 18.16,58.78 26.94,67.56 26.94,73.37 v31.94,78.37
N$46  (via drill 0.35)
  Top 0.203: v27.76,58.98 18.98,50.21 18.98,48.17 OR1.1 | v35.1,77.46 36.13,77.46 36.23,77.56 OK3.7
  Bottom 0.203: v27.76,58.98 27.76,70.11 v35.1,77.46
N$47
  Top 0.203: 19.95,58.63 18.88,57.56 13.27,57.56 12.96,57.25 OF8.2 | 19.95,58.63 20,58.68 20.72,58.68 D1.2 | 19.95,58.63 19.49,59.09 19.49,62.15 17.96,63.68 17.96,67.76 17.35,68.37 17.35,68.88 U1.18
N$48
  Top 0.203: OR3.1 47.86,85.93 43.47,85.93 42.76,85.21 OK3.16
N$49
  Top 0.203: D2.2 16.74,58.78 16.74,60.92 12.96,64.7 OF6.2 12.96,64.8 14.08,65.92 14.08,68.68 16.84,71.44 17.25,71.44 U1.16
N$50  (via drill 0.35)
  Top 0.203: v18.68,60.82 18.68,58.78 D2.1 | v12.96,66.54 12.96,68.48 OF5.2 | v15.72,72.66 17.25,72.66 U1.15
  Bottom 0.203: v18.68,60.82 v12.96,66.54 13.06,66.54 15.72,69.19 v15.72,72.66
N$51
  Top 0.203: OF7.1 10,60.92 5,60.92 XO.9
N$52
  Top 0.203: OF6.1 10,64.8 5,64.8 XO.8
N$53
  Top 0.203: OR3.2 47.86,85.11 45.82,85.11 43.37,82.66 42.76,82.66 OK3.14
N$54
  Top 0.203: OF5.1 10,68.48 5,68.48 XO.7
N$55
  Top 0.203: OF4.1 10,72.25 5,72.25 XO.6
N$56
  Top 0.203: OR3.3 47.86,84.29 46.84,84.29 42.76,80.21 OK3.12
N$57
  Top 0.203: D3.1 22.76,64.5 22.76,61.33 23.98,60.11 23.98,57.66 22.25,55.92 12.04,55.92 11.33,56.64 11.33,74.39 12.86,75.92 OF3.2 12.96,75.92 13.57,75.31 17.25,75.31 U1.13
N$58
  Top 0.203: OR3.4 47.86,83.48 47.86,82.76 42.76,77.66 OK3.10
N$59  (via drill 0.35)
  Top 0.203: v16.74,67.97 16.74,64.6 D4.2 | U1.12 17.25,76.54 16.74,76.03 v15.72,76.03 12.96,78.78 12.96,79.7 OF2.2
  Bottom 0.203: v16.74,67.97 16.74,75.01 v15.72,76.03
N$60
  Top 0.203: OK3.2 36.23,83.89 31.94,83.89 31.84,83.78 OL1.A
N$61
  Top 0.203: OK3.4 36.23,81.33 33.17,81.33 31.84,80.01 OL2.A
N$62
  Top 0.203: OK3.6 36.23,78.78 35,78.78 32.55,76.33 31.84,76.33 OL3.A
N$63
  Top 0.203: OK3.8 36.23,76.23 35.82,76.23 31.84,72.25 OL4.A
N$64  (via drill 0.35)
  Top 0.203: v18.78,68.17 18.78,64.6 D4.1 | v18.88,75.92 18.88,76.74 17.86,77.76 17.35,77.76 U1.11 17.25,77.86 16.84,77.86 16.02,78.68 16.02,78.78 12.96,81.84 12.96,83.48 OF1.2
  Bottom 0.203: v18.78,68.17 18.78,75.82 v18.88,75.92
N$65
  Top 0.203: D3.2 20.72,64.6 20.72,71.13 17.86,73.99 17.35,73.99 U1.14 17.25,73.99 16.02,73.99 14.29,72.25 12.96,72.25 OF4.2
N$66
  Top 0.203: OF3.1 10,76.03 5.1,76.03 5,76.13 XO.5
N$67
  Top 0.203: OF2.1 10,79.8 5.1,79.8 5,79.91 XO.4
N$68
  Top 0.203: OF1.1 10,83.58 5.1,83.58 5,83.68 XO.3
N$69  (via drill 0.35)
  Top 0.203: v28.06,54.49 27.25,54.49 22.14,49.39 22.14,48.17 OR4.4 | v38.06,64.5 38.06,69.39 36.53,70.92 OK4.1
  Bottom 0.203: v38.06,64.5 v28.06,54.49
N$70  (via drill 0.35)
  Top 0.203: v22.86,49.09 22.86,48.17 OR4.3 | v37.66,63.07 37.66,63.88 37.35,64.19 37.35,67.56 36.53,68.37 OK4.3
  Bottom 0.203: v22.86,49.09 23.68,49.09 v37.66,63.07
N$71
  Top 0.203: OR4.2 23.68,48.17 23.68,49.09 28.78,54.19 28.78,57.66 30.82,59.7 30.82,60.92 35.72,65.82 36.43,65.82 OK4.5
N$72
  Top 0.203: OR4.1 24.49,48.17 24.49,49.29 30.82,55.62 30.82,57.56 36.53,63.27 OK4.7
N$73
  Top 0.203: OR5.1 47.86,73.88 45.92,73.88 43.06,71.03 OK4.16
N$74
  Top 0.203: OR5.2 47.86,73.07 47.55,73.07 44.7,70.21 44.7,68.78 44.29,68.37 43.06,68.37 OK4.14
N$75
  Top 0.203: OR5.3 47.86,72.25 47.55,72.25 45.11,69.8 45.11,67.97 43.06,65.92 OK4.12
N$76
  Top 0.203: OR5.4 47.86,71.54 47.86,70.72 45.51,68.37 45.51,65.82 43.06,63.37 OK4.10
N$77
  Top 0.203: OK4.2 36.43,69.6 33.17,69.6 31.84,68.27 OL5.A
N$78
  Top 0.203: OK4.4 36.43,67.05 34.59,67.05 31.84,64.29 OL6.A
N$79
  Top 0.203: OK4.6 36.43,64.5 36.02,64.5 31.84,60.31 OL7.A
N$80
  Top 0.203: OK4.8 36.43,62.05 36.43,60.92 31.84,56.33 OL8.A
OI1
  Top 0.203: 41.48,84.65 42.15,83.99 42.66,83.99 OK3.15 | 41.48,84.65 41.43,84.7 41.43,85.72 42.66,86.95 49.8,86.95 51.33,85.42 51.33,83.07 50.72,82.46 50.11,82.46 47.96,80.31 47.96,80.01 OR2.1 | 41.48,84.65 40.11,83.27 33.37,83.27 30.82,80.72 30.82,79.39 29.29,77.86 26.74,77.86 U1.8
OI2
  Top 0.203: 41.89,82.2 42.66,81.44 OK3.13 | 41.89,82.2 41.84,82.25 41.84,82.97 42.15,83.27 43.37,83.27 43.58,83.48 43.58,84.29 43.37,84.5 42.25,84.5 41.84,84.91 41.84,85.52 42.86,86.54 49.6,86.54 50.92,85.21 50.92,83.27 50.52,82.86 49.7,82.86 47.15,80.31 47.15,79.6 47.55,79.19 47.86,79.19 OR2.2 | 41.89,82.2 40.51,80.82 35.72,80.82 33.98,79.09 31.64,79.09 30,77.46 29.19,77.46 28.37,76.64 26.74,76.64 U1.7
OI3
  Top 0.203: 41.89,77.2 41.84,77.25 41.84,77.97 42.66,78.78 OK3.11 | 41.89,77.2 42.15,76.95 43.37,76.95 44.7,78.27 47.86,78.27 OR2.3 | 41.89,77.2 41.64,76.95 35.62,76.95 33.98,75.31 26.74,75.31 U1.6
OI4
  Top 0.203: OR2.4 47.86,77.46 44.49,77.46 43.37,76.33 42.76,76.33 OK3.9 42.66,76.23 39.29,76.23 34.39,71.33 31.02,71.33 30.82,71.54 30.82,72.86 29.7,73.99 26.74,73.99 U1.5
RAW_IV
  Top 0.254: 40.51,25.92 40.51,34.8 GPIO.1 | 40.51,25.92 36.64,22.04 PC1.+ | 53.58,14.08 63.58,14.08 64.6,13.06 64.6,12.14 66.23,10.51 68.78,10.51 70.72,8.57 PF1.2 | 53.58,14.08 52.96,14.08 50.62,11.74 50.01,11.74 PIC33.1 | 40.51,25.92 52.66,25.92 53.58,25 53.58,14.08
RD+
  Top 0.203: 67.45,34.39 68.88,34.39 U$2.RD+ | 67.45,34.39 66.23,34.39 64.29,32.45 61.13,32.45 ERN1.6 | 67.45,34.39 67.45,31.84 65.62,30 59.6,30 59.19,30.41 55.01,30.41 53.88,31.53 53.88,31.74 50.72,34.9 47.96,34.9 ENC.13
RD-  (via drill 0.35)
  Top 0.203: v65.11,31.12 64.7,31.53 61.13,31.53 ERN1.5 | v52.35,35.51 47.96,35.51 ENC.12
  Bottom 0.203: v65.11,31.12 68.27,31.12 68.58,30.82 69.29,30.82 70.01,31.53 70.01,37.35 69.19,38.17 66.44,38.17 U$2.RD- 66.33,38.17 63.68,35.51 v52.35,35.51
RESET  (via drill 0.35)
  Top 0.203: 56.64,81.23 58.07,81.23 C2.1 58.17,81.33 59.09,82.25 61.03,82.25 67.45,88.68 68.48,88.68 BL.5 | 56.64,81.23 55.92,81.23 R2.1 | v59.09,68.88 61.74,68.88 62.25,69.39 62.45,69.39 MC.29 | 56.64,81.23 v56.64,76.44
  Bottom 0.203: v59.09,68.88 56.43,71.54 56.43,76.23 v56.64,76.44 | SR.1 81.44,21.02 81.44,23.98 80.42,25 80.42,26.12 80.52,26.23 80.52,28.57 78.37,30.72 78.37,49.19 74.5,53.07 74.5,68.68 69.9,73.27 69.9,79.19 70.21,79.5 70.21,81.95 70.31,82.05 70.31,86.95 68.58,88.68 BL.5
RXI
  Top 0.203: MC.30 62.97,68.78 62.97,68.48 59.8,65.31 59.8,59.8 72.15,47.45 PP.4
TD+  (via drill 0.35)
  Top 0.203: v57.45,32.66 58.68,33.88 59.8,33.88 ERN1.1 | v57.25,34.19 55.92,35.51 55.21,35.51 ENC.17
  Bottom 0.203: U$2.TD+ 68.88,31.84 64.8,31.84 64.7,31.74 58.58,31.74 57.66,32.66 v57.45,32.66 57.25,32.86 v57.25,34.19
TD-
  Top 0.203: 58.02,32.2 57.15,31.33 55.82,31.33 55.62,31.53 55.62,33.37 56.23,33.98 56.23,34.59 55.92,34.9 55.21,34.9 ENC.16 | 58.02,32.2 58.17,32.35 58.17,32.76 58.58,33.17 59.8,33.17 ERN1.2 | 58.02,32.2 59.8,30.41 65.41,30.41 66.33,31.33 66.33,33.06 U$2.TD-
TXO
  Top 0.203: MC.31 63.58,68.27 60.21,64.9 60.21,60.31 70.52,50.01 72.15,50.01 PP.3
VDDO  (via drill 0.35)
  Top 0.254: OR5.5 49.19,71.64 49.19,72.25 OR5.6 49.19,72.46 49.19,73.07 OR5.7 49.09,73.27 49.09,73.88 OR5.8 49.19,73.99 v49.19,76.64 | OR3.8 49.19,85.93 49.19,85.21 OR3.7 49.19,85.11 49.19,84.39 OR3.6 49.19,84.29 49.19,83.58 OR3.5 49.29,83.58 v50.21,83.58 | D2.3 21.74,56.74 D1.3 21.84,56.84 22.25,56.84 23.47,58.07 23.47,59.9 21.64,61.74 21.64,62.25 D3.3 | v18.78,61.84 18.16,62.45 17.76,62.45 D4.3 | v20.72,62.35 21.64,62.35 21.74,62.45 D3.3 | D3.3 21.64,62.56 21.64,75.31 17.86,79.09 17.45,79.09 U1.10 17.35,79.09 17.35,79.6 24.08,86.33 24.08,90.42 OMF.1 24.19,90.52 28.98,90.52 OD2.C 29.08,90.62 30.51,92.05 39.7,92.05 40.92,90.83 41.64,90.83 EC6.+ 41.74,90.72 42.05,90.42 v43.27,90.42
  Bottom 0.254: v49.19,76.64 49.19,79.5 50.21,80.52 v50.21,83.58 50.11,83.58 v43.27,90.42 | v18.78,61.84 20.21,61.84 v20.72,62.35
VIN
  Top 0.203: PJ1.VIN0 81.95,4.39 80.52,5.82 74.29,5.82 72.76,4.29 70.21,4.29 PD1.A 70.11,4.18 67.35,1.43 31.12,1.43 24.9,7.65 24.9,14.49 16.12,23.27 16.12,29.8 14.9,31.02 13.57,31.02 13.16,30.61 9.29,30.61 8.78,31.12 8.78,40.41 5,44.19 5,47.25 XV.2
WFGPIO0
  Bottom 0.203: WIFI.GPIO0 67.25,64.29 67.25,63.27 65.72,61.74 65.72,61.43 54.49,50.21 40.62,50.21 GPIO.13
WFGPIO2
  Bottom 0.203: WIFI.GPIO2 64.7,64.29 63.88,64.29 62.45,62.86 50.72,62.86 38.06,50.21 GPIO.14

## Text on the board
tPlace: Edge | IOTECH © 2019 | IOTB v2.3 TOP | www.iotech.com.tr | S/N:
bPlace: IOTECH | IOTB BOT